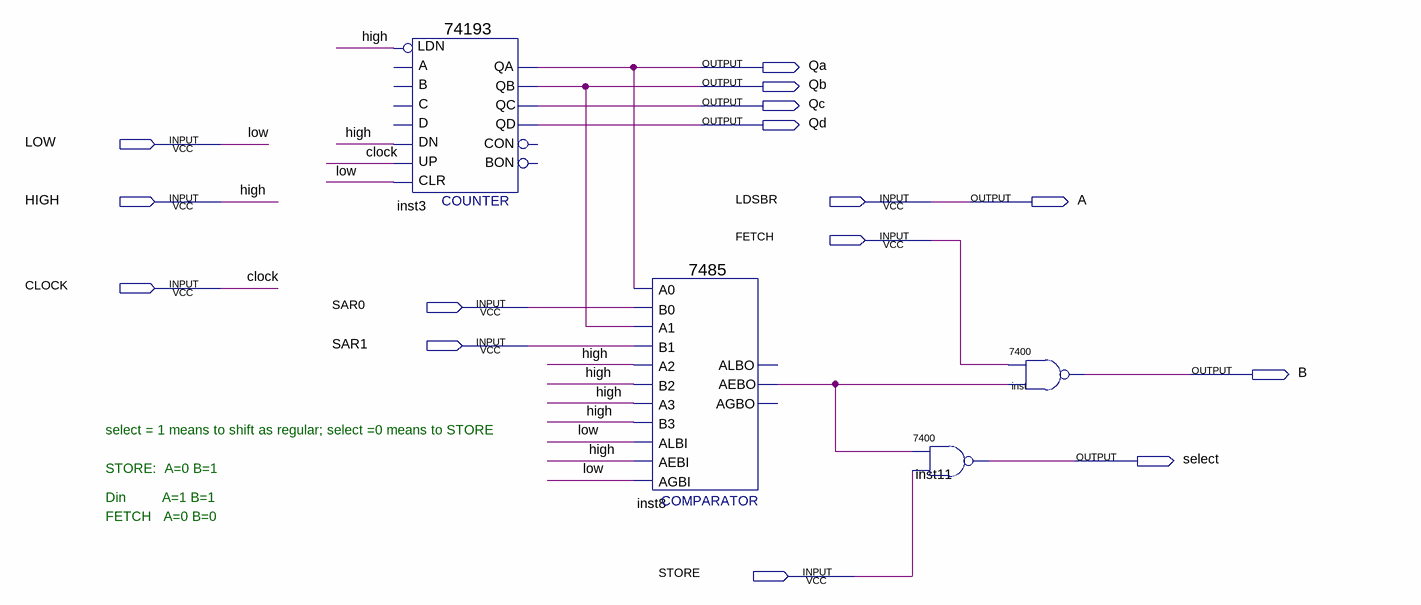
[diagram p0: schematic sheet]
// Quartus schematic control_logic_test.bdf as structural Verilog: 4 symbols, 15 pins
module control_logic_test (
  input  LOW,
  input  HIGH,
  input  LDSBR,
  input  FETCH,
  input  CLOCK,
  input  SAR0,
  input  SAR1,
  input  STORE,
  output Qa,
  output Qb,
  output Qc,
  output Qd,
  output A,
  output B,
  output select
);

  wire inst8_aebo;

  \74193  inst3 (
    .CLR(LOW), .UP(CLOCK), .DN(HIGH), .LDN(HIGH), .QB(Qb), .QA(Qa), .QD(Qd), .QC(Qc));  // open: D, C, B, A, CON, BON
  \7485  inst8 (
    .A3(HIGH), .B2(HIGH), .A2(HIGH), .AEBI(HIGH), .AGBI(LOW), .ALBI(LOW), .A0(Qa), .B0(SAR0), .B3(HIGH),
    .A1(Qb), .B1(SAR1), .AEBO(inst8_aebo));  // open: ALBO, AGBO
  \7400  inst11 (.\3 (STORE), .\2 (inst8_aebo), .\1 (select));
  \7400  inst (.\3 (inst8_aebo), .\2 (FETCH), .\1 (B));

  assign A = LDSBR;

  // Notes on the sheet:
  //   select = 1 means to shift as regular; select =0 means to STORE
  //   STORE:  A=0 B=1 
  //   Din         A=1 B=1
  //   FETCH   A=0 B=0
endmodule
